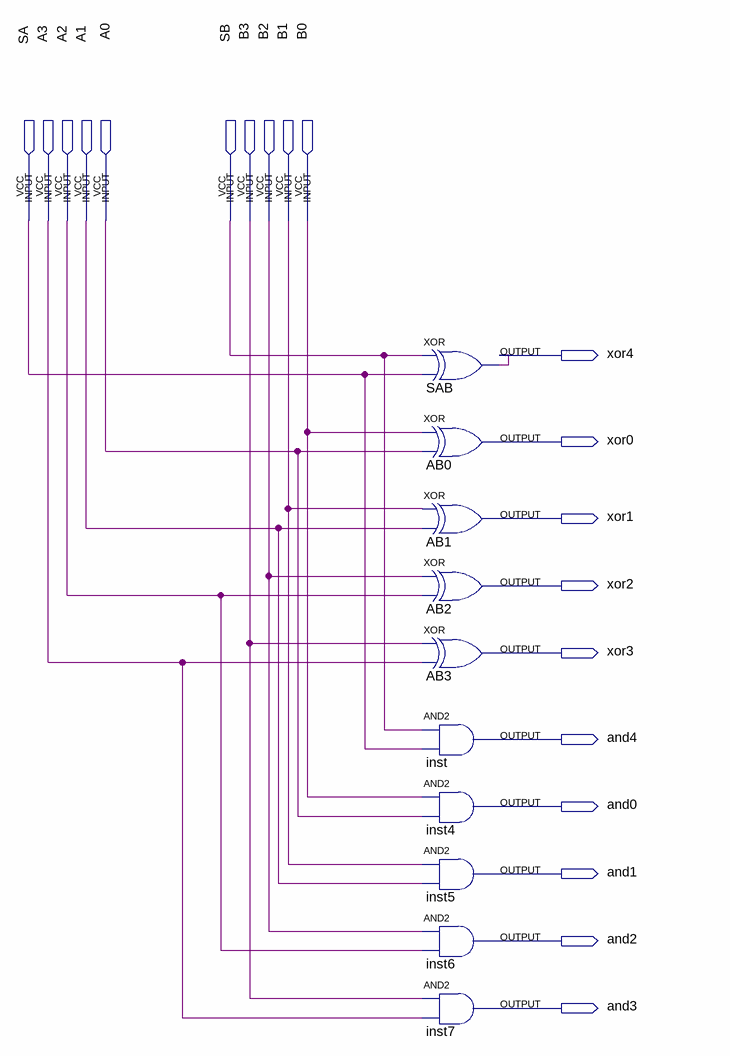
[diagram p0: schematic sheet]
// Quartus schematic blocos_logicos.bdf as structural Verilog: 10 symbols, 20 pins
module blocos_logicos (
  input  SA,
  input  A3,
  input  A2,
  input  A1,
  input  A0,
  input  SB,
  input  B3,
  input  B2,
  input  B1,
  input  B0,
  output xor4,
  output xor0,
  output xor1,
  output xor2,
  output xor3,
  output and4,
  output and0,
  output and1,
  output and2,
  output and3
);

  xor SAB (xor4, SB, SA);
  xor AB0 (xor0, B0, A0);
  xor AB1 (xor1, B1, A1);
  xor AB2 (xor2, B2, A2);
  xor AB3 (xor3, B3, A3);
  and inst (and4, SB, SA);
  and inst4 (and0, B0, A0);
  and inst5 (and1, B1, A1);
  and inst6 (and2, B2, A2);
  and inst7 (and3, B3, A3);
endmodule
